# Altium schematic sheet CTR_PAD.SchDoc
size A3; SheetNumber: 1; SheetTotal: 1
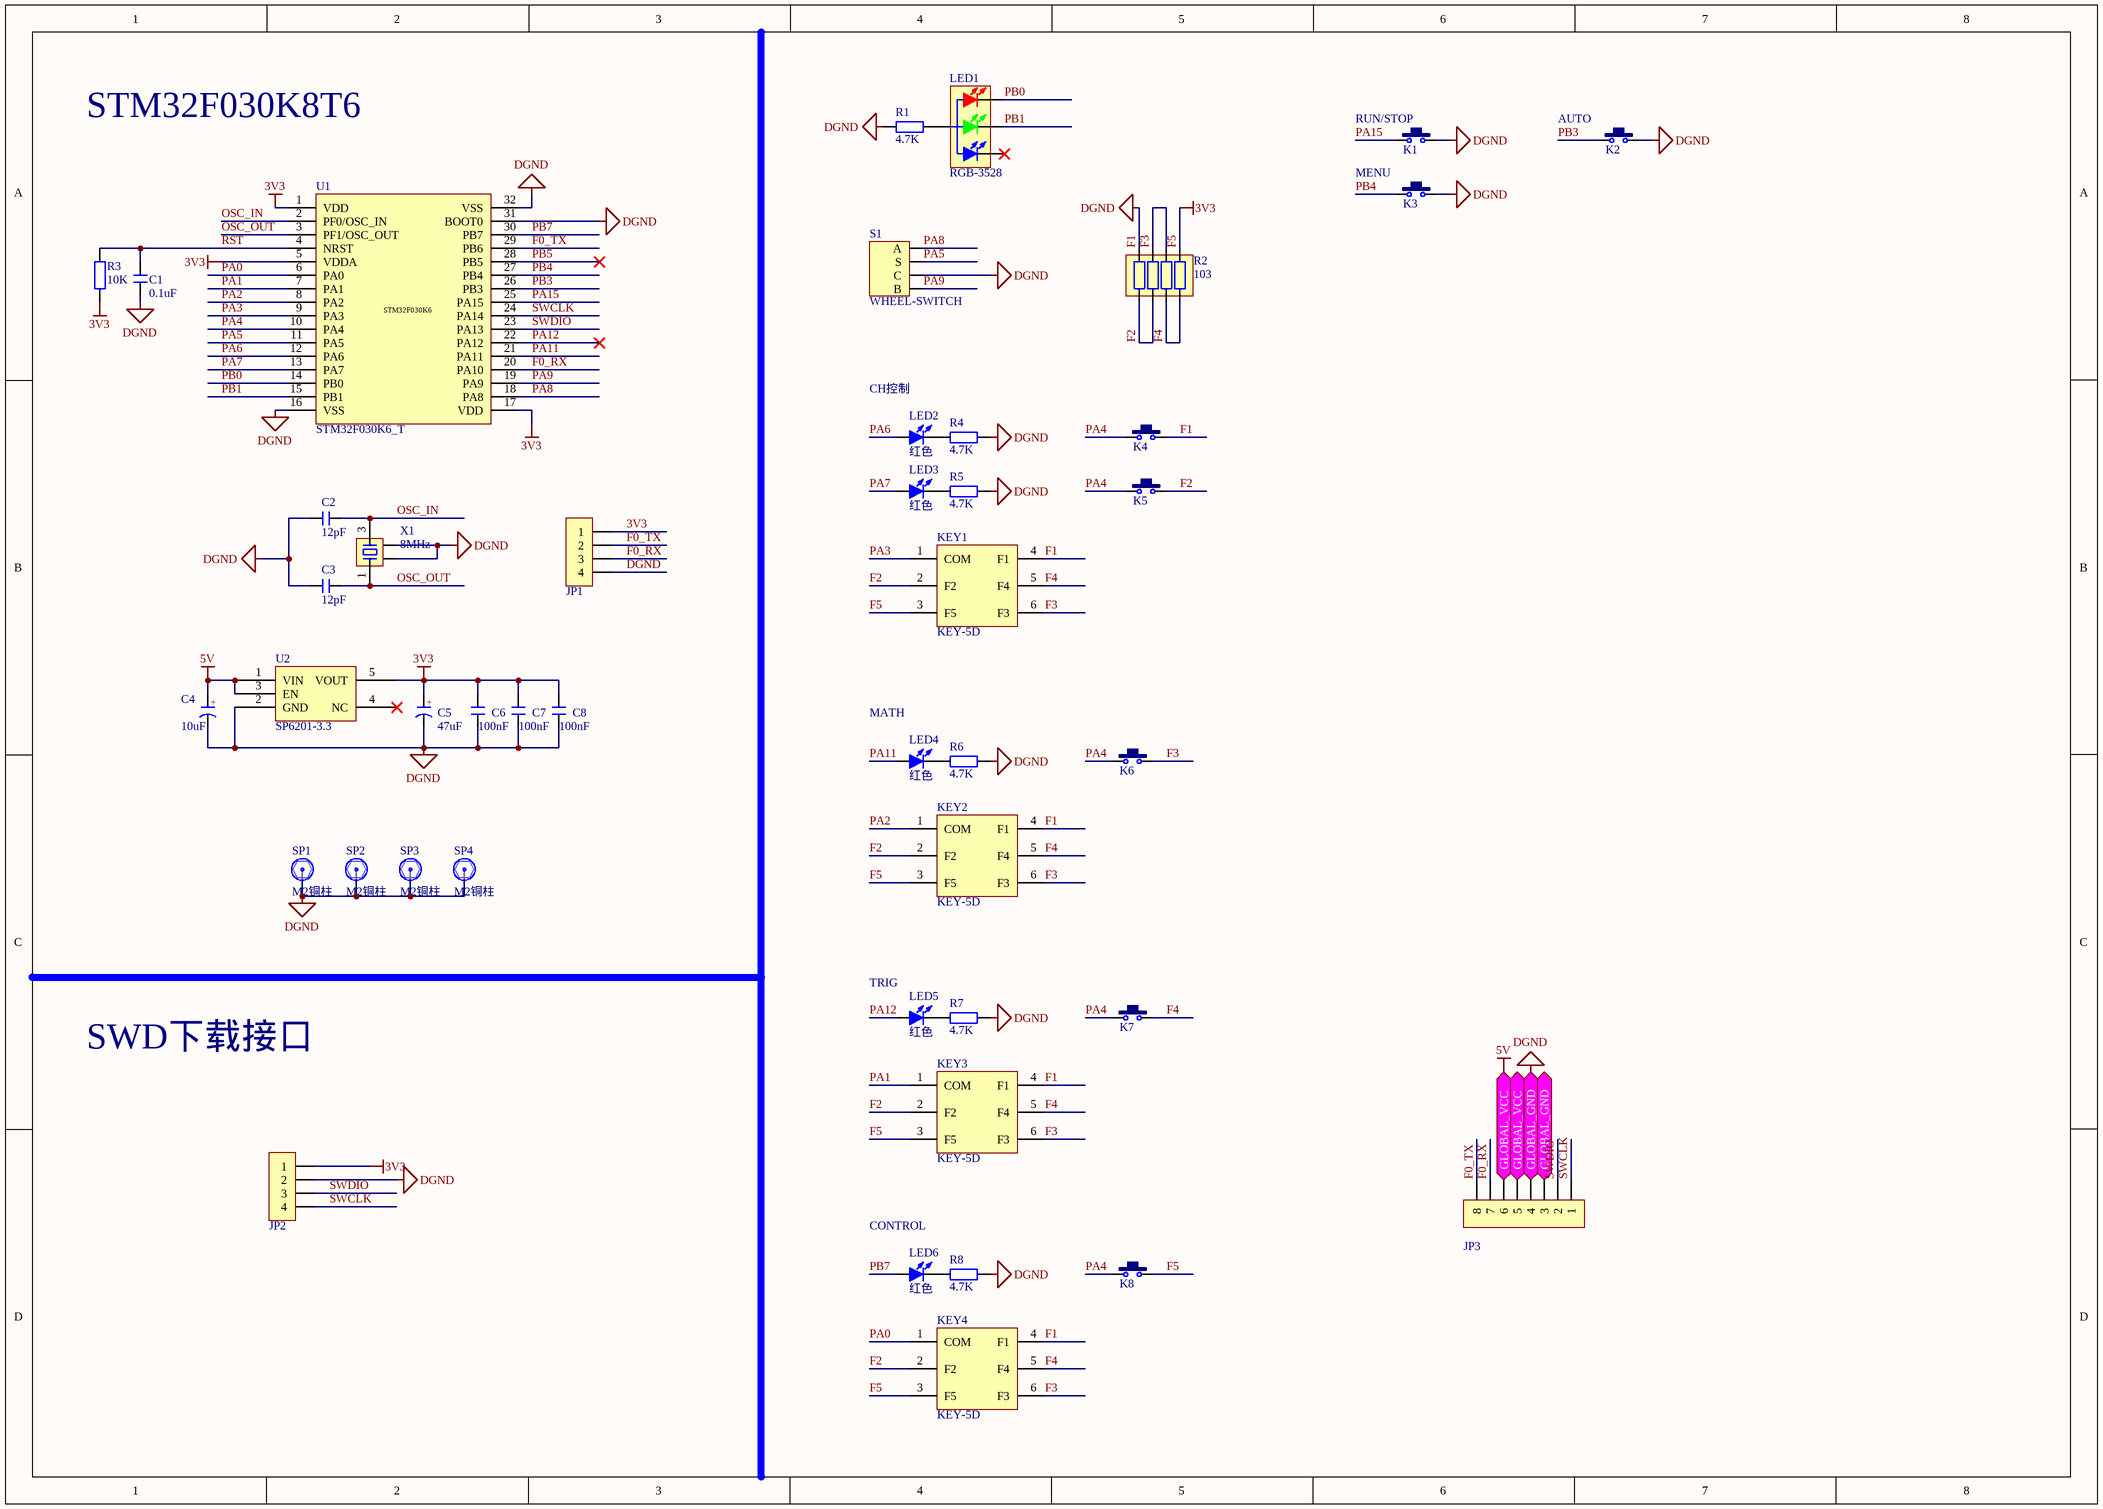
[diagram p0: CTR_PAD.SchDoc]

## Parts
C1  0.1uF  [C 0603_L]
C2  12pF  [C 0603_L]
C3  12pF  [C 0603_L]
C4  10uF  [CD A(3216)]
C5  47uF  [CD A(3216)]
C6  100nF  [C 0603_L]
C7  100nF  [C 0603_L]
C8  100nF  [C 0603_L]
JP1  HDR-1X4  [HDR2.54-LI-4P]  (value not drawn)
JP2  HDR-1X4  [MX 1.25-WS-4P]  (value not drawn)
JP3  FPC1.0-8P  [FPC0.5 2H-WS-8P]  (value not drawn)
K1  6x6x5  [TSW SMD-6*6*4.3]  (value not drawn)
K2  6x6x5  [TSW SMD-6*6*4.3]  (value not drawn)
K3  6x6x5  [TSW SMD-6*6*4.3]  (value not drawn)
K4  6x6x5  [TSW SMD-6*6*4.3]  (value not drawn)
K5  6x6x5  [TSW SMD-6*6*4.3]  (value not drawn)
K6  6x6x5  [TSW SMD-6*6*4.3]  (value not drawn)
K7  6x6x5  [TSW SMD-6*6*4.3]  (value not drawn)
K8  6x6x5  [TSW SMD-6*6*4.3]  (value not drawn)
KEY1  KEY-5D  [KEY-5D-SMD]
KEY2  KEY-5D  [KEY-5D-SMD]
KEY3  KEY-5D  [KEY-5D-SMD]
KEY4  KEY-5D  [KEY-5D-SMD]
LED1  RGB-3528  [LED 3528-4Pin]
LED2  红色  [LED 0805Y]
LED3  红色  [LED 0805Y]
LED4  红色  [LED 0805R]
LED5  红色  [LED 0805R]
LED6  红色  [LED 0805R]
R1  4.7K  [R 0603_L]
R2  103  [RCA-8P4R-0603]
R3  10K  [R 0603_L]
R4  4.7K  [R 0603_L]
R5  4.7K  [R 0603_L]
R6  4.7K  [R 0603_L]
R7  4.7K  [R 0603_L]
R8  4.7K  [R 0603_L]
S1  WHEEL-SWITCH  [WHEEL-SWITCH]
SP1  M2铜柱  [M2]
SP2  M2铜柱  [M2]
SP3  M2铜柱  [M2]
SP4  M2铜柱  [M2]
U1  STM32F030K6_T  [LQFP32 7X7_N]
U2  SP6201-3.3  [SOT23-5L]
X1  8MHz  [OSC 3225-4P]

## Ports
GLOBAL_GND (bidir), GLOBAL_VCC (bidir)

## Nets
3V3: C5.1(A) C6.2 C7.2 C8.2 JP1.1 JP2.1 K8.2 KEY1.3(F5) KEY2.3(F5) KEY3.3(F5) KEY4.3(F5) R2.5 R3.2 U1.1(VDD) U1.5(VDDA) U1.17(VDD) U2.5(VOUT)  [also labelled F5]
5V: C4.1(A) JP3.5 JP3.6 U2.1(VIN) U2.3(EN) ; port GLOBAL_VCC
DGND: C1.1 C2.1 C3.1 C4.2(K) C5.2(K) C6.1 C7.1 C8.1 JP1.4 JP2.2 JP3.3 JP3.4 K1.2 K2.2 K3.2 K4.2 KEY1.4(F1) KEY2.4(F1) KEY3.4(F1) KEY4.4(F1) R1.2 R2.8 R4.1 R5.1 R6.1 R7.1 R8.1 S1.C SP1.1 SP2.1 SP3.1 SP4.1 U1.16(VSS) U1.31(BOOT0) U1.32(VSS) U2.2(GND) X1.2 X1.4 ; port GLOBAL_GND  [also labelled F1]
F0_RX: JP1.3 JP3.7 U1.20(PA10)
F0_TX: JP1.2 JP3.8 U1.29(PB6)
F2: K5.2 KEY1.2(F2) KEY2.2(F2) KEY3.2(F2) KEY4.2(F2) R2.1 R2.2
F3: K6.2 KEY1.6(F3) KEY2.6(F3) KEY3.6(F3) KEY4.6(F3) R2.6 R2.7
F4: K7.2 KEY1.5(F4) KEY2.5(F4) KEY3.5(F4) KEY4.5(F4) R2.3 R2.4
OSC_IN: C2.2 U1.2(PF0/OSC_IN) X1.3
OSC_OUT: C3.2 U1.3(PF1/OSC_OUT) X1.1
PA0: KEY4.1(COM) U1.6(PA0)
PA1: KEY3.1(COM) U1.7(PA1)
PA2: KEY2.1(COM) U1.8(PA2)
PA3: KEY1.1(COM) U1.9(PA3)
PA4: K4.1 K5.1 K6.1 K7.1 K8.1 U1.10(PA4)
PA5: S1.S U1.11(PA5)
PA6: LED2.1(A) U1.12(PA6)
PA7: LED3.1(A) U1.13(PA7)
PA8: S1.A U1.18(PA8)
PA9: S1.B U1.19(PA9)
PA11: LED4.1(A) U1.21(PA11)
PA12: LED5.1(A) U1.22(PA12)
PA15: K1.1 U1.25(PA15)
PB0: LED1.1(RED_K) U1.14(PB0)
PB1: LED1.2(GREEN_K) U1.15(PB1)
PB3: K2.1 U1.26(PB3)
PB4: K3.1 U1.27(PB4)
PB5: U1.28(PB5)
PB7: LED6.1(A) U1.30(PB7)
RST: C1.2 R3.1 U1.4(NRST)
SWCLK: JP2.4 JP3.1 U1.24(PA14)
SWDIO: JP2.3 JP3.2 U1.23(PA13)
NetLED1_4: LED1.4(A) R1.1
NetLED2_2: LED2.2(K) R4.2
NetLED3_2: LED3.2(K) R5.2
NetLED4_2: LED4.2(K) R6.2
NetLED5_2: LED5.2(K) R7.2
NetLED6_2: LED6.2(K) R8.2

Not connected (* = marked no-connect by the designer): LED1 3(BULE_K)*; U2 4(NC)*

## Notes on the sheet
- STM32F030K8T6
- (near K1) RUN/STOP
- MENU
- (near K2) AUTO
- (near LED2) CH控制
- (near LED4) MATH
- (near LED5) TRIG
- SWD下载接口
- CONTROL
- (in symbol C-CD) +
- (in symbol STM32F030K6_T) STM32F030K6

## Library data of the parts
C1-C3 C6-C8 = C: 无极性贴片电容; 版权归属: 源创客; BOM名称: 无极性贴片电容; 学习资源: www.ooocke.com
C4 C5 = C-CD: 贴片钽电容; 版权归属: 源创客; BOM名称: 贴片钽电容; 学习资源: www.ooocke.com
JP1 JP2 = Header 4: 4P接插件; 版权归属: 源创客; BOM名称: 4P接插件; 学习资源: www.ooocke.com
JP3 = FPC-8P: FPC连接器; 版权归属: 源创客; BOM名称: FPC连接器; 学习资源: www.ooocke.com
K1-K8 = KEY-SMD-6x6: 贴片6x6轻触开关; 版权归属: 源创客; BOM名称: 贴片6x6轻触开关; 学习资源: www.ooocke.com
KEY1-KEY4 = KEY-5D: 五向按键
LED1 = LED-RGB-3528: 三基色LED; 版权归属: 源创客; BOM名称: 三基色LED; 学习资源: www.ooocke.com
LED2-LED6 = LED-SMD: 贴片LED; 版权归属: 源创客; BOM名称: 贴片LED; 学习资源: www.ooocke.com
R1 R3-R8 = R: 贴片电阻; 版权归属: 源创客; BOM名称: 贴片电阻; 学习资源: www.ooocke.com
R2 = R-8P4R: 贴片网络排阻; 版权归属: 源创客; BOM名称: 贴片网络排阻; 学习资源: www.ooocke.com
S1 = WHEEL-SWITCH: 拨盘编码器
SP1-SP4 = M2铜柱: BOM名称: 铜柱; 版权归属: 源创客; 学习资源: www.ooocke.com
U1 = STM32F030K6_T: 微型控制器
U2 = SP6201-3.3: 线性稳压器
X1 = XTAL-4P: 4脚无源晶振; 版权归属: 源创客; BOM名称: 4脚无源晶振; 学习资源: www.ooocke.com